# Altium schematic sheet FPGA_Bank_0.SchDoc
size A3
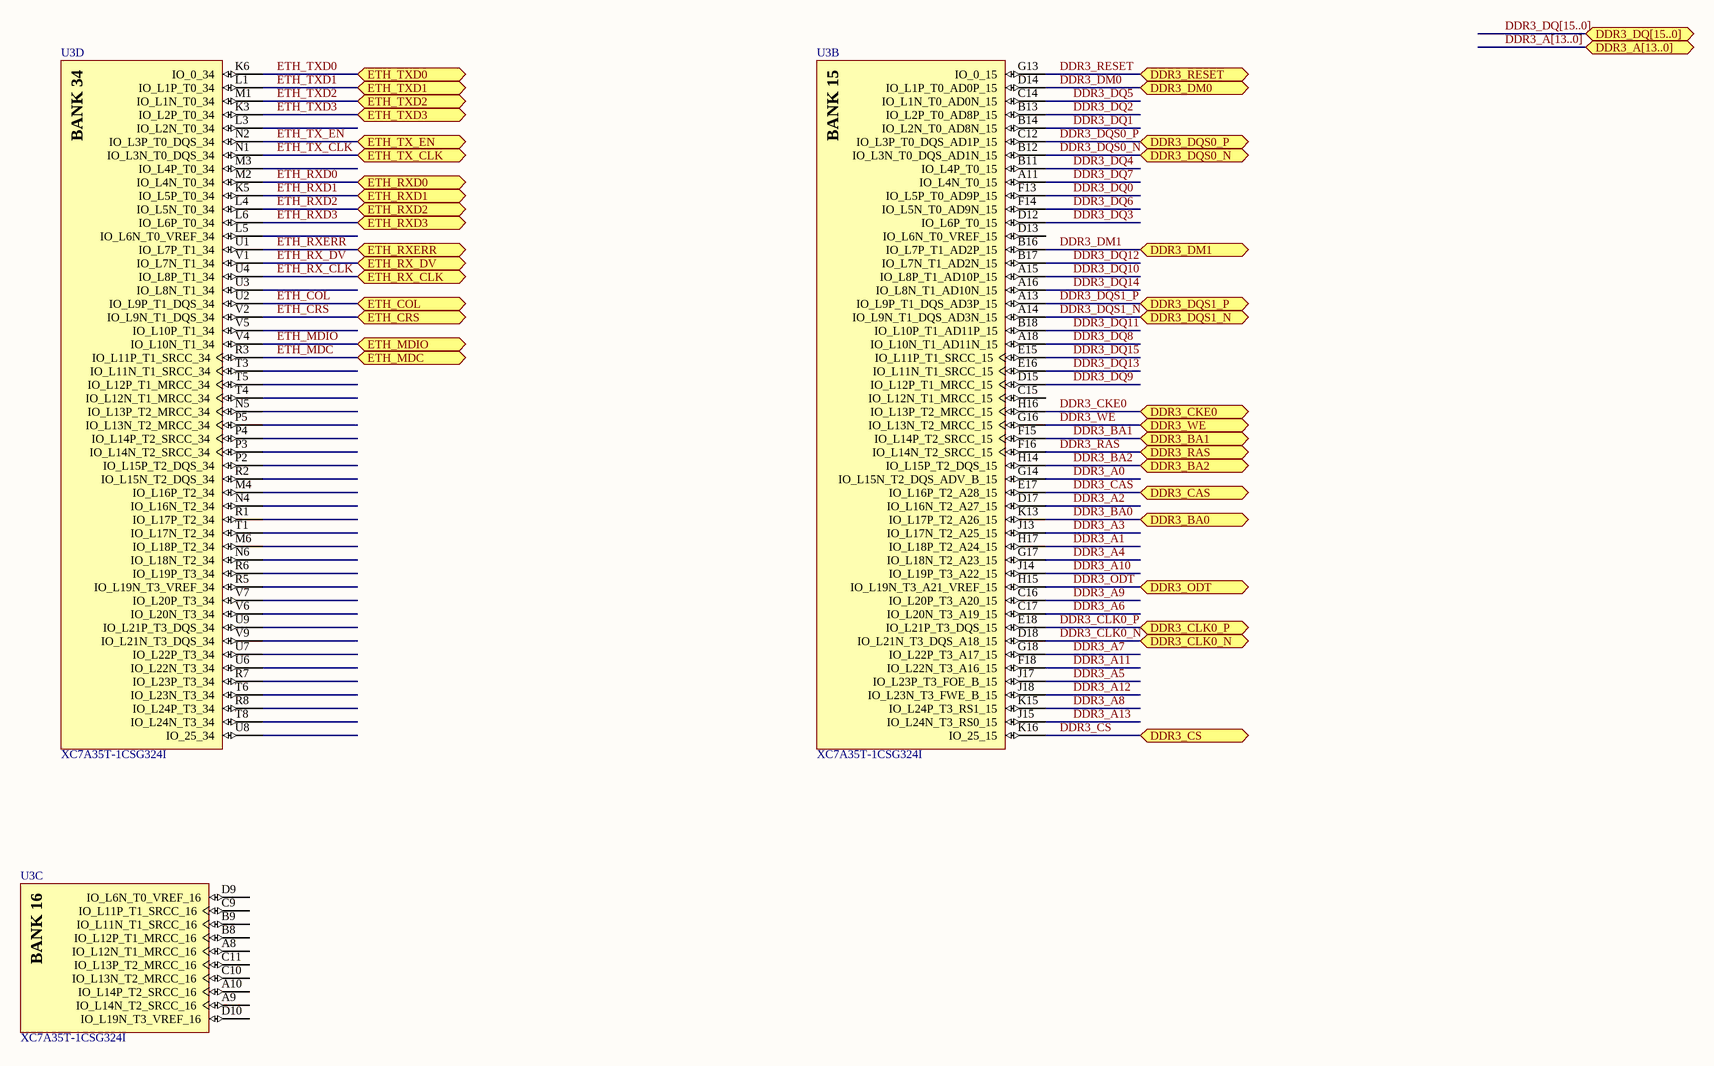
[diagram p0: FPGA_Bank_0.SchDoc]

## Parts
U3  XC7A35T-1CSG324I  [CSG324]  (parts B,C,D of 9)

## Ports
DDR3_A[13..0], DDR3_BA0, DDR3_BA1, DDR3_BA2, DDR3_CAS, DDR3_CKE0, DDR3_CLK0_N, DDR3_CLK0_P, DDR3_CS, DDR3_DM0, DDR3_DM1, DDR3_DQ[15..0], DDR3_DQS0_N, DDR3_DQS0_P, DDR3_DQS1_N, DDR3_DQS1_P, DDR3_ODT, DDR3_RAS, DDR3_RESET, DDR3_WE, ETH_COL, ETH_CRS, ETH_MDC, ETH_MDIO, ETH_RX_CLK, ETH_RX_DV, ETH_RXD0, ETH_RXD1, ETH_RXD2, ETH_RXD3, ETH_RXERR, ETH_TX_CLK, ETH_TX_EN, ETH_TXD0, ETH_TXD1, ETH_TXD2, ETH_TXD3

## Nets
DDR3_A0: U3.G14(IO_L15N_T2_DQS_ADV_B_15)
DDR3_A1: U3.H17(IO_L18P_T2_A24_15)
DDR3_A2: U3.D17(IO_L16N_T2_A27_15)
DDR3_A3: U3.J13(IO_L17N_T2_A25_15)
DDR3_A4: U3.G17(IO_L18N_T2_A23_15)
DDR3_A5: U3.J17(IO_L23P_T3_FOE_B_15)
DDR3_A6: U3.C17(IO_L20N_T3_A19_15)
DDR3_A7: U3.G18(IO_L22P_T3_A17_15)
DDR3_A8: U3.K15(IO_L24P_T3_RS1_15)
DDR3_A9: U3.C16(IO_L20P_T3_A20_15)
DDR3_A10: U3.J14(IO_L19P_T3_A22_15)
DDR3_A11: U3.F18(IO_L22N_T3_A16_15)
DDR3_A12: U3.J18(IO_L23N_T3_FWE_B_15)
DDR3_A13: U3.J15(IO_L24N_T3_RS0_15)
DDR3_BA0: U3.K13(IO_L17P_T2_A26_15) ; port DDR3_BA0
DDR3_BA1: U3.F15(IO_L14P_T2_SRCC_15) ; port DDR3_BA1
DDR3_BA2: U3.H14(IO_L15P_T2_DQS_15) ; port DDR3_BA2
DDR3_CAS: U3.E17(IO_L16P_T2_A28_15) ; port DDR3_CAS
DDR3_CKE0: U3.H16(IO_L13P_T2_MRCC_15) ; port DDR3_CKE0
DDR3_CLK0_N: U3.D18(IO_L21N_T3_DQS_A18_15) ; port DDR3_CLK0_N
DDR3_CLK0_P: U3.E18(IO_L21P_T3_DQS_15) ; port DDR3_CLK0_P
DDR3_CS: U3.K16(IO_25_15) ; port DDR3_CS
DDR3_DM0: U3.D14(IO_L1P_T0_AD0P_15) ; port DDR3_DM0
DDR3_DM1: U3.B16(IO_L7P_T1_AD2P_15) ; port DDR3_DM1
DDR3_DQ0: U3.F13(IO_L5P_T0_AD9P_15)
DDR3_DQ1: U3.B14(IO_L2N_T0_AD8N_15)
DDR3_DQ2: U3.B13(IO_L2P_T0_AD8P_15)
DDR3_DQ3: U3.D12(IO_L6P_T0_15)
DDR3_DQ4: U3.B11(IO_L4P_T0_15)
DDR3_DQ5: U3.C14(IO_L1N_T0_AD0N_15)
DDR3_DQ6: U3.F14(IO_L5N_T0_AD9N_15)
DDR3_DQ7: U3.A11(IO_L4N_T0_15)
DDR3_DQ8: U3.A18(IO_L10N_T1_AD11N_15)
DDR3_DQ9: U3.D15(IO_L12P_T1_MRCC_15)
DDR3_DQ10: U3.A15(IO_L8P_T1_AD10P_15)
DDR3_DQ11: U3.B18(IO_L10P_T1_AD11P_15)
DDR3_DQ12: U3.B17(IO_L7N_T1_AD2N_15)
DDR3_DQ13: U3.E16(IO_L11N_T1_SRCC_15)
DDR3_DQ14: U3.A16(IO_L8N_T1_AD10N_15)
DDR3_DQ15: U3.E15(IO_L11P_T1_SRCC_15)
DDR3_DQS0_N: U3.B12(IO_L3N_T0_DQS_AD1N_15) ; port DDR3_DQS0_N
DDR3_DQS0_P: U3.C12(IO_L3P_T0_DQS_AD1P_15) ; port DDR3_DQS0_P
DDR3_DQS1_N: U3.A14(IO_L9N_T1_DQS_AD3N_15) ; port DDR3_DQS1_N
DDR3_DQS1_P: U3.A13(IO_L9P_T1_DQS_AD3P_15) ; port DDR3_DQS1_P
DDR3_ODT: U3.H15(IO_L19N_T3_A21_VREF_15) ; port DDR3_ODT
DDR3_RAS: U3.F16(IO_L14N_T2_SRCC_15) ; port DDR3_RAS
DDR3_RESET: U3.G13(IO_0_15) ; port DDR3_RESET
DDR3_WE: U3.G16(IO_L13N_T2_MRCC_15) ; port DDR3_WE
ETH_COL: U3.U2(IO_L9P_T1_DQS_34) ; port ETH_COL
ETH_CRS: U3.V2(IO_L9N_T1_DQS_34) ; port ETH_CRS
ETH_MDC: U3.R3(IO_L11P_T1_SRCC_34) ; port ETH_MDC
ETH_MDIO: U3.V4(IO_L10N_T1_34) ; port ETH_MDIO
ETH_RX_CLK: U3.U4(IO_L8P_T1_34) ; port ETH_RX_CLK
ETH_RX_DV: U3.V1(IO_L7N_T1_34) ; port ETH_RX_DV
ETH_RXD0: U3.M2(IO_L4N_T0_34) ; port ETH_RXD0
ETH_RXD1: U3.K5(IO_L5P_T0_34) ; port ETH_RXD1
ETH_RXD2: U3.L4(IO_L5N_T0_34) ; port ETH_RXD2
ETH_RXD3: U3.L6(IO_L6P_T0_34) ; port ETH_RXD3
ETH_RXERR: U3.U1(IO_L7P_T1_34) ; port ETH_RXERR
ETH_TX_CLK: U3.N1(IO_L3N_T0_DQS_34) ; port ETH_TX_CLK
ETH_TX_EN: U3.N2(IO_L3P_T0_DQS_34) ; port ETH_TX_EN
ETH_TXD0: U3.K6(IO_0_34) ; port ETH_TXD0
ETH_TXD1: U3.L1(IO_L1P_T0_34) ; port ETH_TXD1
ETH_TXD2: U3.M1(IO_L1N_T0_34) ; port ETH_TXD2
ETH_TXD3: U3.K3(IO_L2P_T0_34) ; port ETH_TXD3

Not connected (* = marked no-connect by the designer): U3 A8(IO_L12N_T1_MRCC_16) A9(IO_L14N_T2_SRCC_16) A10(IO_L14P_T2_SRCC_16) B8(IO_L12P_T1_MRCC_16) B9(IO_L11N_T1_SRCC_16) C9(IO_L11P_T1_SRCC_16) C10(IO_L13N_T2_MRCC_16) C11(IO_L13P_T2_MRCC_16) C15(IO_L12N_T1_MRCC_15) D9(IO_L6N_T0_VREF_16) D10(IO_L19N_T3_VREF_16) D13(IO_L6N_T0_VREF_15) L3(IO_L2N_T0_34) L5(IO_L6N_T0_VREF_34) M3(IO_L4P_T0_34) M4(IO_L16P_T2_34) M6(IO_L18P_T2_34) N4(IO_L16N_T2_34) N5(IO_L13P_T2_MRCC_34) N6(IO_L18N_T2_34) P2(IO_L15P_T2_DQS_34) P3(IO_L14N_T2_SRCC_34) P4(IO_L14P_T2_SRCC_34) P5(IO_L13N_T2_MRCC_34) R1(IO_L17P_T2_34) R2(IO_L15N_T2_DQS_34) R5(IO_L19N_T3_VREF_34) R6(IO_L19P_T3_34) R7(IO_L23P_T3_34) R8(IO_L24P_T3_34) T1(IO_L17N_T2_34) T3(IO_L11N_T1_SRCC_34) T4(IO_L12N_T1_MRCC_34) T5(IO_L12P_T1_MRCC_34) T6(IO_L23N_T3_34) T8(IO_L24N_T3_34) U3(IO_L8N_T1_34) U6(IO_L22N_T3_34) U7(IO_L22P_T3_34) U8(IO_25_34) U9(IO_L21P_T3_DQS_34) V5(IO_L10P_T1_34) V6(IO_L20N_T3_34) V7(IO_L20P_T3_34) V9(IO_L21N_T3_DQS_34)

## Buses and harness runs
bus DDR3_A[13..0] = port DDR3_A[13..0]
bus DDR3_DQ[15..0] = port DDR3_DQ[15..0]

## Notes on the sheet
- (in symbol XC7A35T-1CSG324I, part B) BANK 15
- (in symbol XC7A35T-1CSG324I, part C) BANK 16
- (in symbol XC7A35T-1CSG324I, part D) BANK 34

## Library data of the parts
U3 = XC7A35T-1CSG324I: Artix-7 FPGA, 210 User I/Os, 0 GTP, 324-Ball BGA, Speed Grade 1, Industrial Grade, Pb-Free; Manufacturer: Xilinx; Total Block RAM: 1800 Kb; GTP: 0; Clock Mgmt Tiles (CMTs): 5; Logic Cells: 33280; Available User I/O: 210; Speed Grades: 1; DatasheetVersion: v1.15; PackageVersion: Rev. 1.11; PackageReference: CSG-324; PackageDescription: 324-Ball Wire-Bond Chip-Scale BGA, Body 15 x 15 mm, Pitch 0.8 mm; Maximum Distributed RAM: 400 Kb; Operating Temperature Range: Industrial; NexusDeviceID: XC7A35T-1CSG324I; Mounting Technology: Surface Mount; PartNumber: XC7A35T-1CSG324I; ComponentLink1Description: Manufacturer URL; ComponentLink1URL: http://www.xilinx.com/; ComponentLink2Description: Datasheet; ComponentLink2URL: http://www.xilinx.com/support/documentation/data_sheets/ds180_7Series_Overview.pdf; ComponentLink3Description: Package Specification; ComponentLink3URL: http://www.xilinx.com/support/documentation/user_guides/ug475_7Series_Pkg_Pinout.pdf; ComponentLink4Description: DC and Switching Characteristics; ComponentLink4URL: http://www.xilinx.com/support/documentation/data_sheets/ds181_Artix_7_Data_Sheet.pdf; ComponentLink5Description: Package File; ComponentLink5URL: http://www.xilinx.com/support/packagefiles/a7packages/xc7a200tsbg484pkg.txt; ComponentLink6Description: Packaging and Pinout; ComponentLink6URL: http://www.xilinx.com/support/documentation/user_guides/ug475_7Series_Pkg_Pinout.pdf